# EAGLE design KS0108_2Wire (EAGLE 7.6.0)
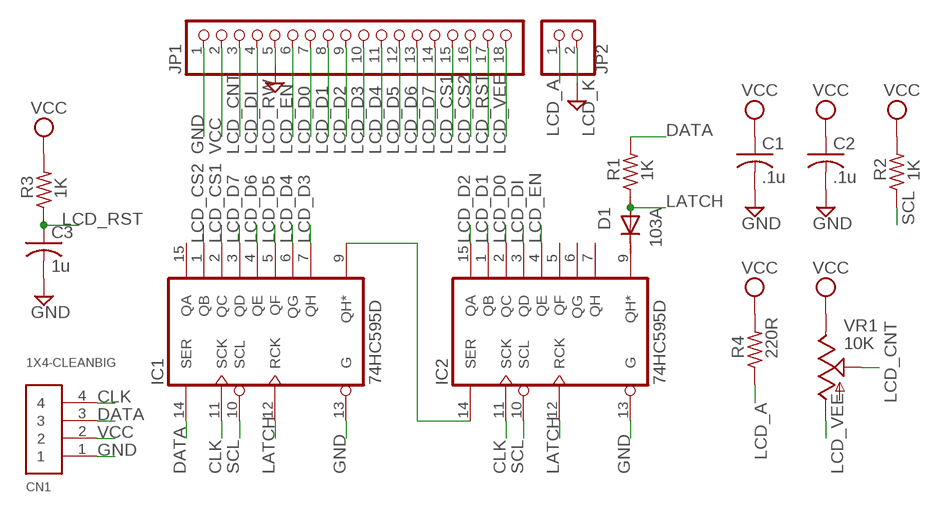
[diagram p0: schematic, sheet 1]

## Parts
C1  .1u  C-USC1206  [C1206]
C2  .1u  C-USC1206  [C1206]
C3  1u  C-USC1206  [C1206]
CN1  1X4-CLEANBIG  [1X04-CLEANBIG]
D1  103A  DIODE-SOD80C  [SOD80C]
IC1  74HC595D  [SO16]
IC2  74HC595D  [SO16]
JP1  PINHD-1X18-BIG  [1X18-BIG]
JP2  HEADER-1X2ROUND  [1X02_ROUND]
R1  1K  R-US_R1206  [R1206]
R2  1K  R-US_R1206  [R1206]
R3  1K  R-US_R1206  [R1206]
R4  220R  R-US_R1206  [R1206]
VR1  10K  TRIM_US-CT6  [CT6]

## Nets
CLK: CN1.4 IC1.11(SCK) IC2.11(SCK)
DATA: CN1.3 IC1.14(SER) R1.2
GND: C1.2 C2.2 C3.2 CN1.1 IC1.13(G) IC2.13(G) JP1.1 JP1.5 JP2.2
LATCH: D1.A IC1.12(RCK) IC2.12(RCK) R1.1
LCD_A: JP2.1 R4.1
LCD_CNT: JP1.3 VR1.S
LCD_CS1: IC1.2(QC) JP1.15
LCD_CS2: IC1.1(QB) JP1.16
LCD_D0: IC2.2(QC) JP1.7
LCD_D1: IC2.1(QB) JP1.8
LCD_D2: IC2.15(QA) JP1.9
LCD_D3: IC1.7(QH) JP1.10
LCD_D4: IC1.6(QG) JP1.11
LCD_D5: IC1.5(QF) JP1.12
LCD_D6: IC1.4(QE) JP1.13
LCD_D7: IC1.3(QD) JP1.14
LCD_DI: IC2.3(QD) JP1.4
LCD_EN: IC2.4(QE) JP1.6
LCD_RST: C3.1 JP1.17 R3.1
LCD_VEE: JP1.18 VR1.A
N$13: IC1.9(QH*) IC2.14(SER)
N$23: D1.C IC2.9(QH*)
SCL: IC1.10(SCL) IC2.10(SCL) R2.1
VCC: C1.1 C2.1 CN1.2 JP1.2 R2.2 R3.2 R4.2 VR1.E
Unconnected: IC1.15(QA) IC2.5(QF) IC2.6(QG) IC2.7(QH)

## Notes on the sheet
- LCD_K
- LCD_RW

## Power pins joined to a net without a drawn wire
GND: IC1.8(GND) IC2.8(GND)
VCC: IC1.16(VCC) IC2.16(VCC)

## Library data of the parts
C1-C3 = rcl:C-US: CAPACITOR, American symbol
CN1 = adafruit:1X4: 4-pin connector
D1 = diode:DIODE-: DIODE
IC1 IC2 = 74xx-eu:74*595: 8-bit SHIFT REGISTER, output latch
JP1 = adafruit:PINHD-1X18: PIN HEADER
JP2 = microbuilder:HEADER-1X2: PIN HEADER
R1-R4 = rcl:R-US_: RESISTOR, American symbol
VR1 = pot:TRIM_US-: POTENTIOMETER

## Net classes
0 default: width 0.254 mm, drill 0.254 mm, clearance 0.254 mm

## Board
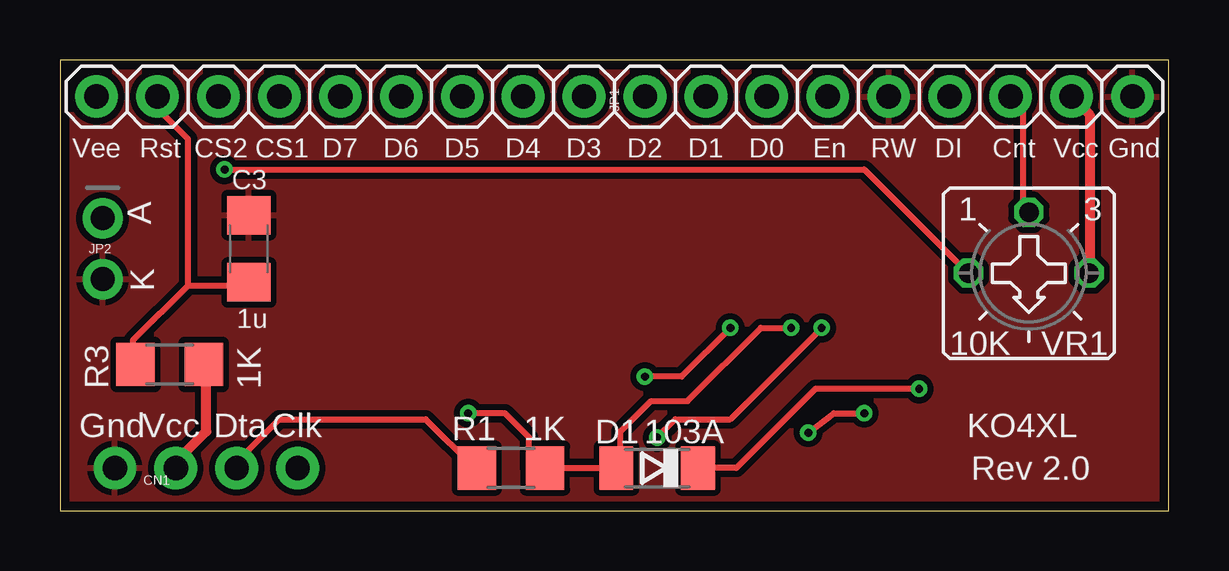
[diagram p1: board, top side]
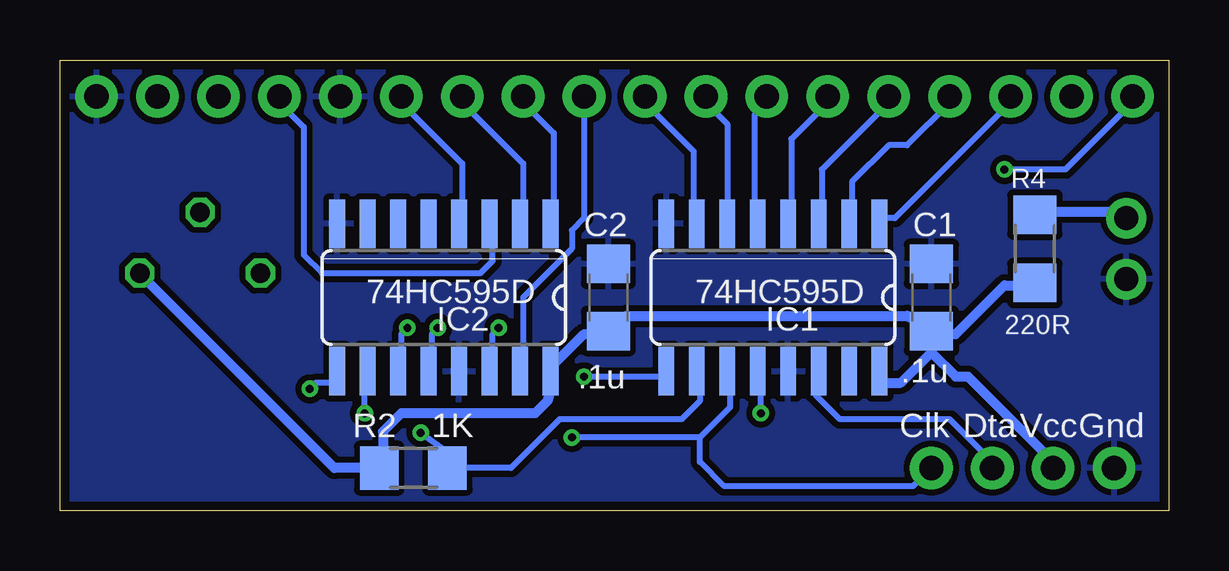
[diagram p2: board, bottom side, seen from below]

Size 46.23 x 18.8 mm. Coordinates in mm from the lower left corner, seen from the top.
Outline: 0,0 46.23,0 46.23,18.8 0,18.8 0,0
Copper layers (1*16): Top 0.0356mm / dielectric 1.5011mm / Bottom 0.0356mm
Design rules "OSHPark": minimum track width 6mil, minimum drill 13mil, track to track 6mil, track to pad 6mil, pad to pad 6mil, via to via 6mil, smd to smd 6mil, copper to edge 15mil, drill to drill 6mil, minimum pad ring 7mil, minimum via ring 7mil, stop-mask expansion 4mil, vias tented up to drill 0mil, thermal gap 10mil

### Footprints (pad centres in the part's own frame; a part is rotated, then mirrored left to right if it is on the bottom)
C1206 = smd 1.6 x 1.8: 1 -1.4,0; 2 1.4,0
1X04-CLEANBIG = drill 1.016 pad 1.778: 1 -3.81,0; 2 -1.27,0; 3 1.27,0; 4 3.81,0
SOD80C = smd 1.4 x 1.8: A 1.7,0; C -1.7,0
SO16 = smd 0.66 x 2.032: 1 -4.445,-3.073; 2 -3.175,-3.073; 3 -1.905,-3.073; 4 -0.635,-3.073; 5 0.635,-3.073; 6 1.905,-3.073; 7 3.175,-3.073; 8 4.445,-3.073; 9 4.445,3.073; 10 3.175,3.073; 11 1.905,3.073; 12 0.635,3.073; 13 -0.635,3.073; 14 -1.905,3.073; 15 -3.175,3.073; 16 -4.445,3.073
1X18-BIG = drill 1.016 pad 1.778: 1 -21.59,0; 2 -19.05,0; 3 -16.51,0; 4 -13.97,0; 5 -11.43,0; 6 -8.89,0; 7 -6.35,0; 8 -3.81,0; 9 -1.27,0; 10 1.27,0; 11 3.81,0; 12 6.35,0; 13 8.89,0; 14 11.43,0; 15 13.97,0; 16 16.51,0; 17 19.05,0; 18 21.59,0
1X02_ROUND = drill 1 pad 1.676: 1 -1.27,0; 2 1.27,0
R1206 = smd 1.6 x 1.803: 1 -1.422,0; 2 1.422,0
CT6 = drill 0.813 octagon: A 2.515,0; E -2.515,0; S 0,-2.54

### Placement (x,y rotation side)
C1  9.91,8.89 90 bottom
C2  23.37,8.89 90 bottom
C3  7.87,10.92 90 top
CN1  6.1,1.78 0 top
D1  24.89,1.78 180 top
IC1  16.51,8.89 180 bottom
IC2  30.23,8.89 180 bottom
JP1  23.11,17.27 180 top
JP2  1.78,10.92 270 top
R1  18.8,1.78 180 top
R2  31.5,1.78 180 bottom
R3  4.57,6.1 0 top
R4  5.59,10.92 270 bottom
VR1  40.39,9.91 180 top

### Tracks (layer width: path | path; a pad name or v marks a point on that pad's centre or on a via)
CLK  (via drill 0.33)
  Top 0.254: v31.75,7.62 27.94,3.81 25.65,3.81 v24.89,3.05
  Bottom 0.254: 19.56,3.05 18.29,4.32 18.29,5.59 IC1.11 | 19.56,3.05 19.56,2.03 18.54,1.02 10.67,1.02 CN1.4 | v31.75,7.62 32,7.37 32,5.84 IC2.11 | 19.56,3.05 v24.89,3.05
DATA
  Top 0.254: R1.2 17.27,1.78 15.24,3.81 9.14,3.81 7.37,2.03 CN1.3
  Bottom 0.254: CN1.3 7.37,2.03 9.14,3.81 13.72,3.81 14.73,4.83 14.73,5.59 IC1.14
GND
  pour Bottom: 0,0 46.23,0 46.23,18.8 0,18.8
  pour Top: 0,0 46.23,0 46.23,18.8 0,18.8
LATCH  (via drill 0.33)
  Top 0.254: v17.02,4.06 18.54,4.06 19.56,3.05 19.56,1.78 R1.1 D1.A 23.37,1.78 23.37,3.3 24.64,4.57 26.16,4.57 29.21,7.62 v30.48,7.62
  Bottom 0.254: v17.02,4.06 17.02,5.59 IC1.12 | v30.48,7.62 30.73,7.37 30.73,5.84 IC2.12
LCD_A
  Bottom 0.254: 5.59,12.45 R4.1
  Bottom 0.406: 5.59,12.45 2.03,12.45 JP2.1
LCD_CNT
  Top 0.254: VR1.S 40.13,12.7 40.13,16.76 JP1.3
LCD_CS1
  Bottom 0.254: JP1.15 9.14,17.02 10.92,15.24 11.68,15.24 13.21,13.72 13.21,12.19 IC1.2
LCD_CS2
  Bottom 0.254: JP1.16 6.6,17.02 11.43,12.19 11.94,12.19 IC1.1
LCD_D0
  Bottom 0.254: JP1.7 29.46,17.02 26.92,14.48 26.92,12.19 IC2.2
LCD_D1
  Bottom 0.254: JP1.8 26.92,17.02 25.65,15.75 25.65,12.19 IC2.1
LCD_D2
  Bottom 0.254: IC2.15 26.92,5.84 26.92,8.89 24.89,10.92 24.89,11.68 24.38,12.19 JP1.9
LCD_D3
  Bottom 0.254: JP1.10 21.84,17.02 19.81,14.99 19.81,12.19 IC1.7
LCD_D4
  Bottom 0.254: JP1.11 19.3,17.02 18.41,16.13 IC1.6
LCD_D5
  Bottom 0.254: JP1.12 16.76,17.02 17.27,16.51 17.27,12.19 IC1.5
LCD_D6
  Bottom 0.254: JP1.13 14.22,17.02 15.75,15.49 15.75,12.19 IC1.4
LCD_D7
  Bottom 0.254: JP1.14 11.68,17.02 14.48,14.22 14.48,12.19 IC1.3
LCD_DI
  Bottom 0.254: JP1.4 37.08,17.02 36.07,16 36.07,10.67 35.31,9.91 28.7,9.91 28.19,10.41 28.19,11.94 IC2.3
LCD_EN
  Bottom 0.254: JP1.6 32,17.02 29.46,14.48 29.46,12.19 IC2.4
LCD_RST
  Top 0.254: 5.33,9.4 7.87,9.4 C3.1 | 5.33,9.4 3.05,7.11 3.05,6.1 R3.1 | JP1.17 4.06,16.76 5.33,15.49 5.33,9.4
LCD_VEE  (via drill 0.33)
  Top 0.254: VR1.A 37.85,9.91 33.53,14.22 v6.86,14.22
  Bottom 0.254: v6.86,14.22 4.32,14.22 1.52,17.02 JP1.18
N$13  (via drill 0.33)
  Top 0.254: v24.38,5.59 25.91,5.59 v27.94,7.62
  Bottom 0.254: v24.38,5.59 21.08,5.59 IC1.9 | v27.94,7.62 28.19,7.37 28.19,5.84 IC2.14
N$23  (via drill 0.33)
  Top 0.254: D1.C 28.19,1.78 31.5,5.08 v35.81,5.08
  Bottom 0.254: v35.81,5.08 35.56,5.33 34.8,5.33 34.54,5.59 IC2.9
SCL  (via drill 0.33)
  Top 0.254: v31.19,3.25 32.26,4.06 v33.53,4.06
  Bottom 0.254: IC1.10 19.56,5.59 19.56,4.57 20.32,3.81 25.4,3.81 27.43,1.78 R2.1 30.23,2.54 v31.19,3.25 | v33.53,4.06 33.53,5.59 IC2.10
VCC
  Top 0.254: 6.1,6.1 R3.2 | 42.93,9.91 VR1.E
  Top 0.406: 6.1,6.1 6.1,3.3 4.83,2.03 CN1.2 | 42.93,9.91 42.93,16.51 JP1.2
  Bottom 0.254: 11.94,5.33 12.19,5.59 IC1.16 | 5.59,9.4 R4.2 | 9.91,7.37 C1.1 9.91,7.62 | 25.65,6.1 25.65,5.84 IC2.16 25.65,5.59 | 32.77,2.03 R2.2 | 42.93,9.91 VR1.E | 23.37,7.37 C2.1
  Bottom 0.406: 9.91,6.6 9.91,7.37 8.89,7.37 6.86,9.4 5.59,9.4 | 9.91,6.6 11.18,5.33 11.94,5.33 | CN1.2 4.83,2.03 8.38,5.59 8.89,5.59 9.91,6.6 | 25.65,6.1 24.38,7.37 23.37,7.37 22.61,8.13 10.92,8.13 9.91,7.62 | 32.77,2.03 32.77,3.3 32,4.06 26.42,4.06 25.91,4.57 25.65,5.59 | 42.93,9.91 34.8,1.78 R2.2

### Text on the board
tPlace: Vee | Rst | CS2 | CS1 | D7 | D6 | D5 | D4 | D3 | D2 | D1 | D0 | En | RW | DI | Cnt | Vcc | Gnd | A | K | Gnd | Vcc | Dta | Clk | KO4XL | Rev 2.0
bPlace: Gnd | Vcc | Dta | Clk